# EAGLE design hifi (EAGLE 7.3.0)
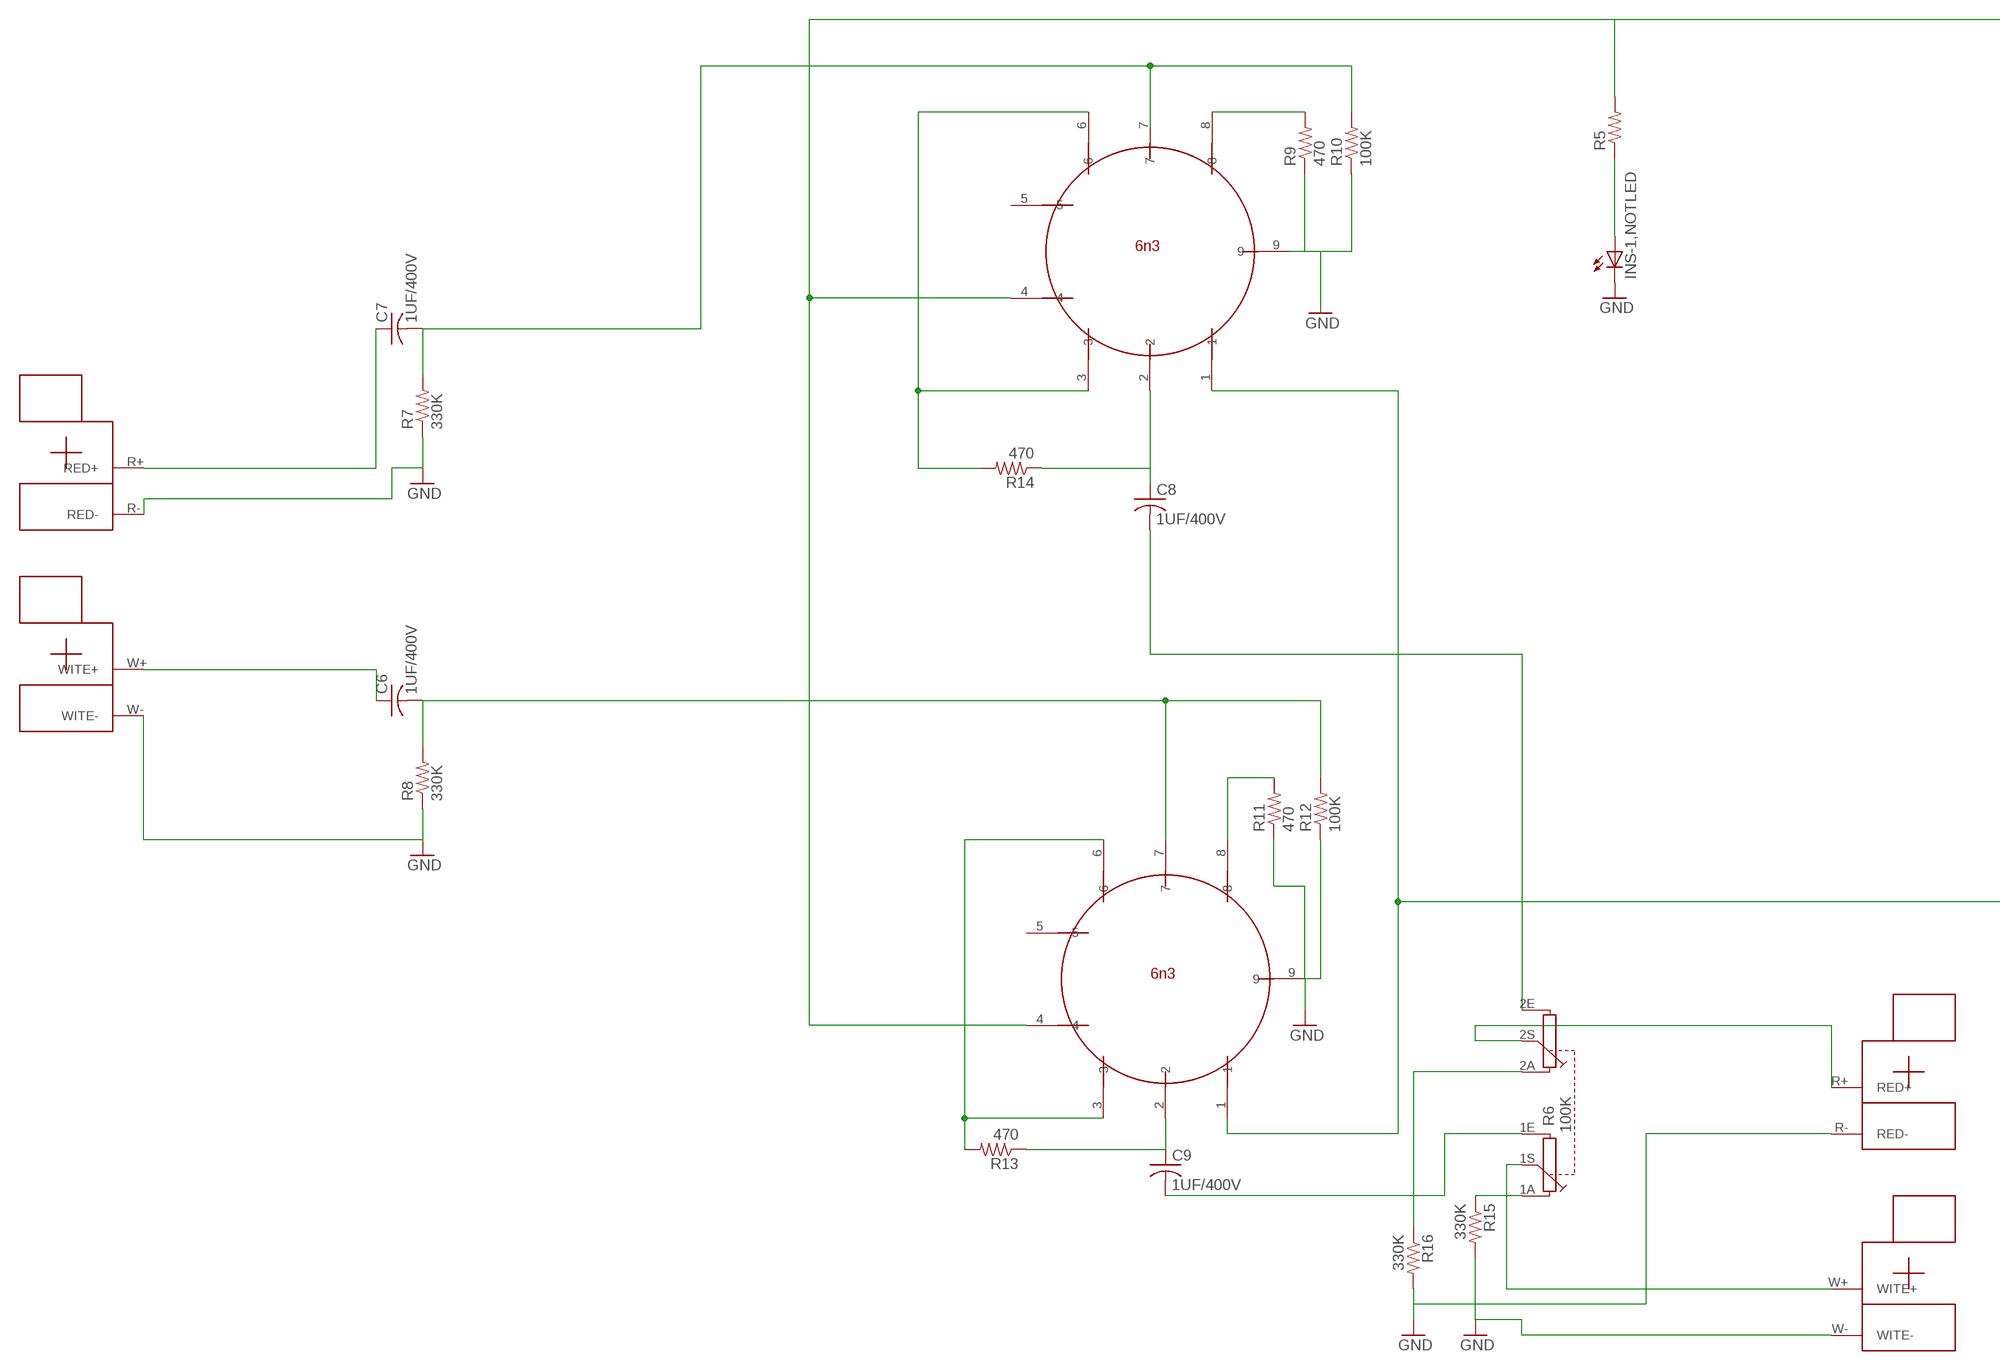
[diagram p0: schematic, sheet 1, part 1 of 2]
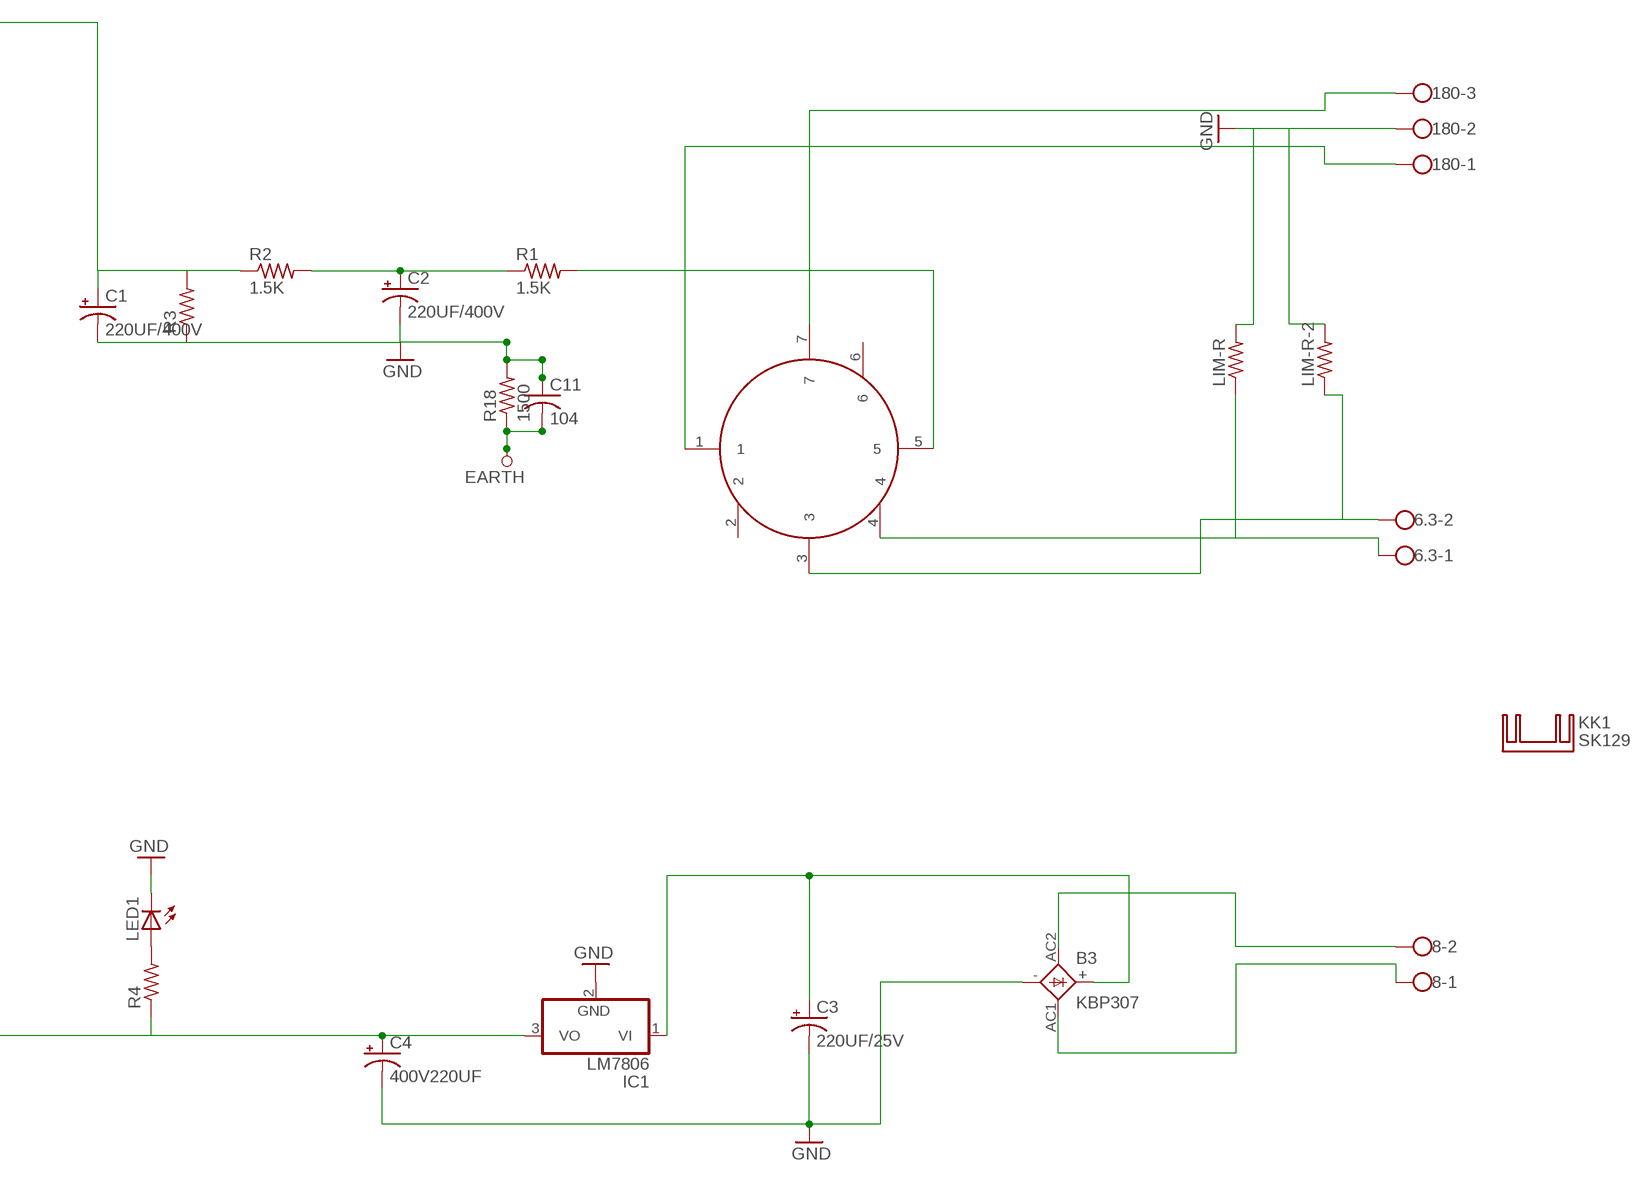
[diagram p1: schematic, sheet 1, part 2 of 2]

## Parts
6.3  W237-102  [W237-102]
8  W237-102  [W237-102]
180  W237-103  [W237-103]
B3  KBP307  KBL  [KBL]
C1  220UF/400V  CPOL-USE10-35  [EB35D]
C2  220UF/400V  CPOL-USE10-35  [EB35D]
C3  220UF/25V  CPOL-USE3.5-10  [E3,5-10]
C4  400V220UF  CPOL-USE10-30  [EB30D]
C6  1UF/400V  C-US375-192X418  [C375-192X418]
C7  1UF/400V  C-US375-192X418  [C375-192X418]
C8  1UF/400V  C-US375-192X418  [C375-192X418]
C9  1UF/400V  C-US375-192X418  [C375-192X418]
C11  104  C-US075-052X106  [C075-052X106]
EARTH  PAD_TERMINAL-4.1MMROUND  [PAD_ROUND_4.1MM]
IC1  LM7806  7805TV  [TO220V]
INS-1,NOTLED  LED5MM  [LED5MM]
KK1  SK129  [SK129-HOLE]
LED1  LED5MM  [LED5MM]
LIM-R  R-US_0207/10  [0207/10]
LIM-R-2  R-US_0207/10  [0207/10]
R1  1.5K  R-US_0309/12  [0309/12]
R2  1.5K  R-US_0309/12  [0309/12]
R3  R-US_0309/12  [0309/12]
R4  R-US_0207/10  [0207/10]
R5  R-US_0309/12  [0309/12]
R6  100K  PC16D  [PC16D]
R7  330K  R-US_0207/10  [0207/10]
R8  330K  R-US_0207/10  [0207/10]
R9  470  R-US_0207/10  [0207/10]
R10  100K  R-US_0207/10  [0207/10]
R11  470  R-US_0207/10  [0207/10]
R12  100K  R-US_0207/10  [0207/10]
R13  470  R-US_0207/10  [0207/10]
R14  470  R-US_0207/10  [0207/10]
R15  330K  R-US_0207/10  [0207/10]
R16  330K  R-US_0207/10  [0207/10]
R18  1500  R-US_0309/12  [0309/12]
U$1  6Z4-SIMPLE  [MINI_P7]
U$2  6N3-SIMPLE  [NOVAL]
U$3  6N3-SIMPLE  [NOVAL]
U$4  RCANEW  [RCA]
U$5  RCANEW  [RCA]

## Nets
GND: 180.2 B3.- C1.- C2.- C3.- C4.- C11.1 IC1.2(GND) INS-1,NOTLED.K(C) LED1.K(C) LIM-R-2.2 LIM-R.2 R3.1 R7.1 R8.1 R11.1 R12.1 R15.2 R16.2 R18.2 U$3.9 U$4.R-(RED-) U$4.W-(WITE-) U$5.R-(RED-) U$5.W-(WITE-)
N$1: 180.3 U$1.7
N$2: 8.2 B3.AC2(AC1)
N$3: 180.1 U$1.1
N$4: 6.3.1 LIM-R.1 U$1.4
N$5: 6.3.2 LIM-R-2.1 U$1.3
N$6: 8.1 B3.AC1(AC2)
N$7: B3.+ C3.+ IC1.1(VI)
N$8: C4.+ IC1.3(VO) R4.1 U$2.1 U$3.1
N$9: INS-1,NOTLED.A R5.1
N$10: C2.+ R1.1 R2.2
N$11: C11.2 EARTH.P R18.1
N$12: C6.1 U$4.W+(WITE+)
N$13: R1.2 U$1.5
N$15: C1.+ R2.1 R3.2 R5.2 U$2.4 U$3.4
N$16: C7.1 U$4.R+(RED+)
N$17: LED1.A R4.2
N$18: R6.1S U$5.W+(WITE+)
N$19: C8.1 R14.1 U$2.2
N$20: C7.2 R7.2 R10.2
N$21: C6.2 R8.2 R12.2 U$3.7
N$22: R14.2 U$2.3 U$2.6
N$23: C8.2 R6.2E
N$24: R6.2A R16.1
N$25: R6.1A R15.1
N$26: C9.2 R6.1E
N$27: C9.1 R13.1 U$3.2
N$30: R13.2 U$3.3 U$3.6
N$31: R6.2S U$5.R+(RED+)
N$32: R9.1 R10.1 U$2.9
N$33: R9.2 U$2.8
N$35: R11.2 U$3.8
Unconnected: U$1.2 U$1.6 U$2.5 U$2.7 U$3.5

## Library data of the parts
6.3 8 = con-wago-500:W237-102: WAGO SCREW CLAMP; MPN: 237-102; OC_FARNELL: unknown; OC_NEWARK: 70K9898
180 = con-wago-500:W237-103: WAGO SCREW CLAMP; MPN: 237-103; OC_FARNELL: unknown; OC_NEWARK: 18M7116
B3 = rectifier:KBL: DIOTEC RECTIFIER
C1-C4 = rcl:CPOL-US: POLARIZED CAPACITOR, American symbol
C6-C9 C11 = rcl:C-US: CAPACITOR, American symbol
EARTH = dp_devices:PAD_TERMINAL: Terminal connection pad
IC1 = linear:78*: Positive VOLTAGE REGULATOR Source: http://cache.national.com/ds/LM/LM78L05.pdf http://www.fairchildsemi.com/ds/LM/LM7805.pdf
INS-1,NOTLED LED1 = adafruit:LED: LED OSRAM: - CHIPLED LG R971, LG N971, LY N971, LG Q971, LY Q971, LO R971, LY R971 LH N974, LH R974 LS Q976, LO Q976, LY Q976 LO Q996 - Hyper CHIPLED LW Q18S LB Q993, LB Q99A, LB R99A - SideLED LS A670, LO A670, LY A670, LG A670, LP A670 LB A673, LV A673, LT A673, LW A673 LH A674 LY A675 LS A676, LA A676, LO A676, LY A676, LW A676 LS A679, LY A679, LG A679 - Hyper Micro SIDELED® LS Y876, LA Y876, LO Y876, LY Y876 LT Y87S - SmartLED LW L88C, LW L88S LB L89C, LB L89S, LG L890 LS L89K, LO L89K, LY L89K LS L896, LA L896, LO L896, LY L896 - TOPLED LS T670, LO T670, LY T670, LG T670, LP T670 LSG T670, LSP T670, LSY T670, LOP T670, LYG T670 LG T671, LOG T671, LSG T671 LB T673, LV T673, LT T673, LW T673 LH T674 LS T676, LA T676, LO T676, LY T676, LB T676, LH T676, LSB T676, LW T676 LB T67C, LV T67C, LT T67C, LS T67K, LO T67K, LY T67K, LW E67C LS E67B, LA E67B, LO E67B, LY E67B, LB E67C, LV E67C, LT E67C LW T67C LS T679, LY T679, LG T679 LS T770, LO T770, LY T770, LG T770, LP T770 LB T773, LV T773, LT T773, LW T773 LH T774 LS E675, LA E675, LY E675, LS T675 LS T776, LA T776, LO T776, LY T776, LB T776 LHGB T686 LT T68C, LB T68C - Hyper Mini TOPLED® LB M676 - Mini TOPLED Santana® LG M470 LS M47K, LO M47K, LY M47K Source: http://www.osram.convergy.de/
KK1 = heatsink:SK129: HEATSINK manufacturer Fischer/distributor Buerklin
LIM-R LIM-R-2 R1-R5 R7-R16 R18 = rcl:R-US_: RESISTOR, American symbol
R6 = piher:PC16D: POTENTIOMETER tandem carbon potentiometer, 16 mm, S3ROH; OC_FARNELL: 4453049; OC_NEWARK: unknown
U$1 = 百年秘制北京特色tube supl:6Z4-SIMPLE
U$2 U$3 = 百年秘制北京特色tube supl:6N3-SIMPLE
U$4 U$5 = con-amphenol:RCANEW

## Board
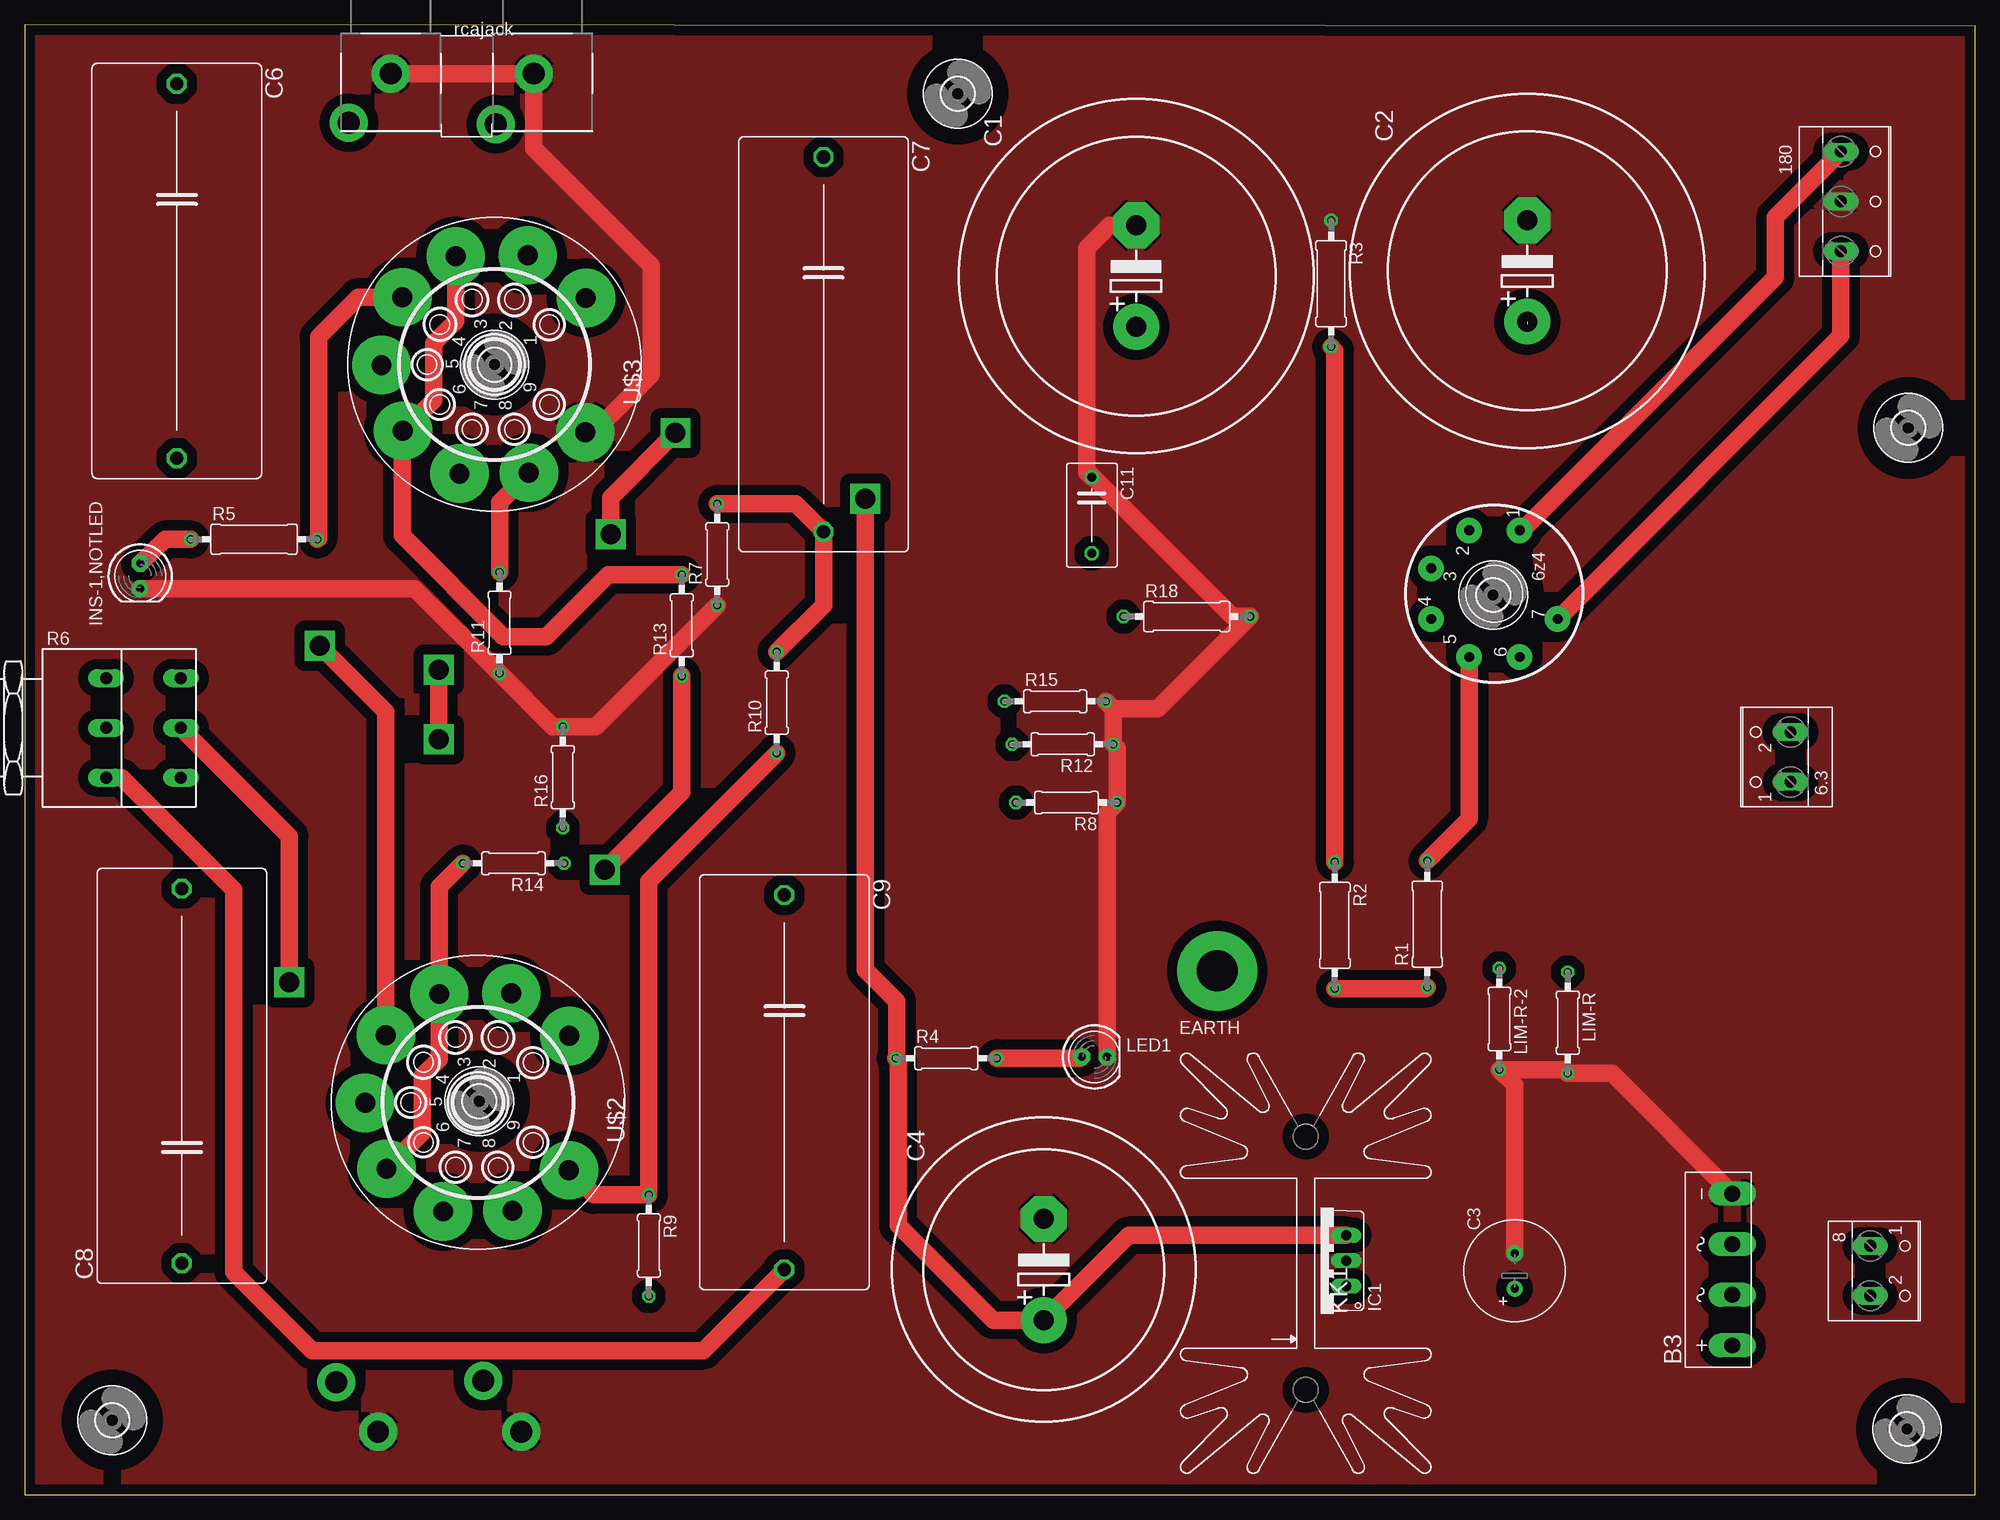
[diagram p2: board, top side]
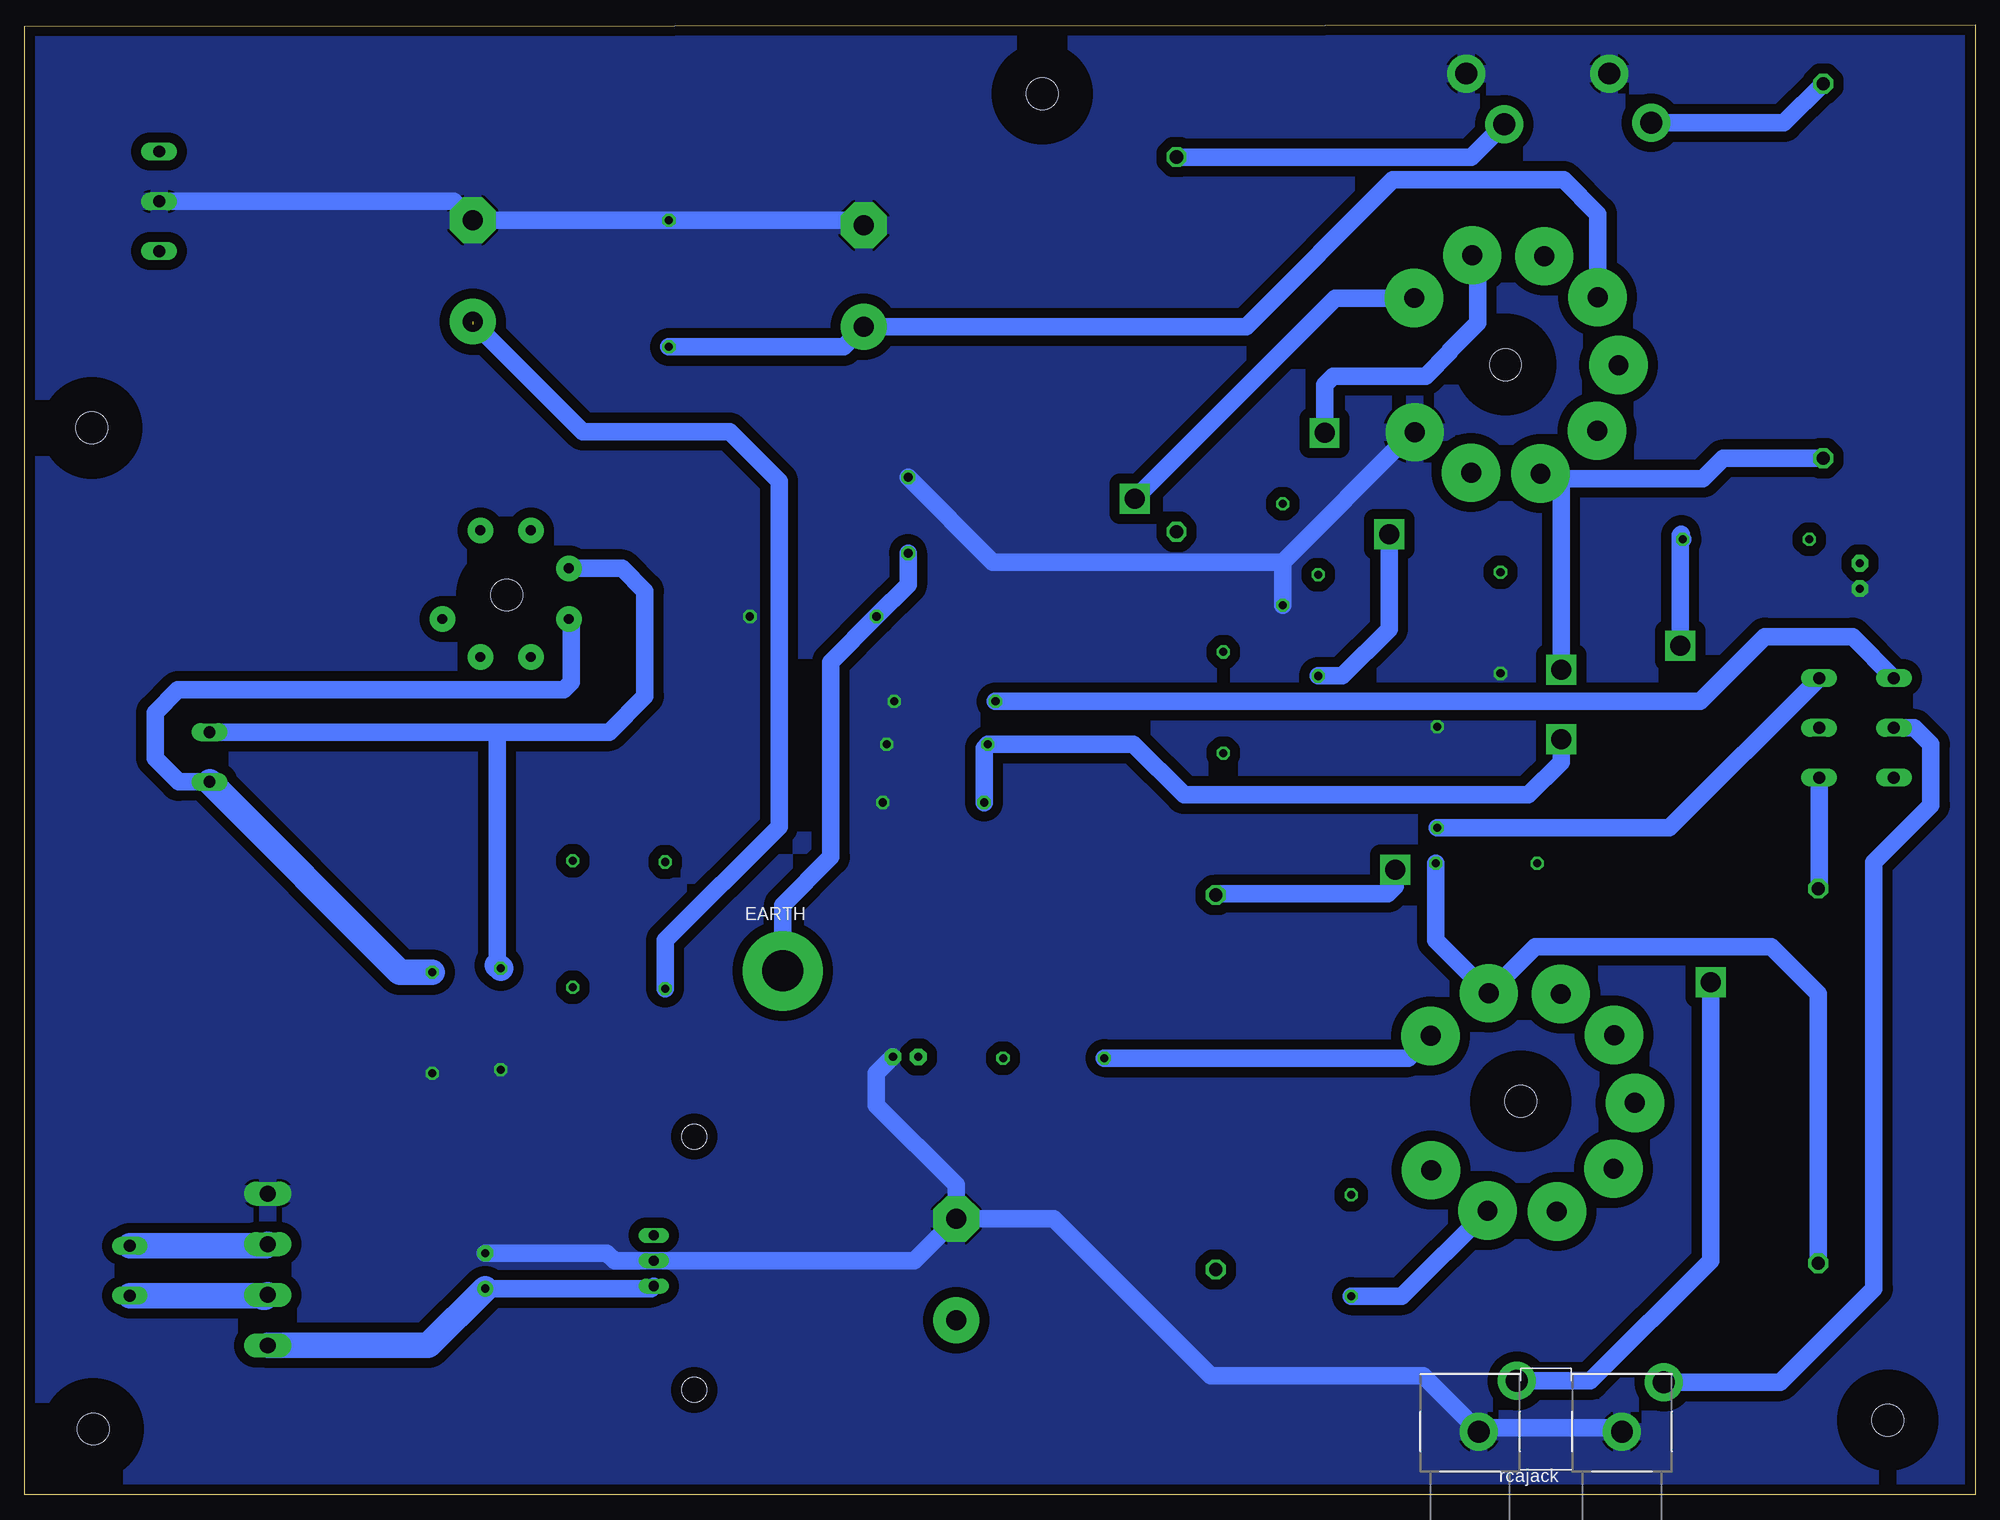
[diagram p3: board, bottom side, seen from below]

Size 195.69 x 147.5 mm. Coordinates in mm from the lower left corner, seen from the top.
Outline: 0,0 195.69,0 195.69,147.37 0,147.5 0,0
Copper layers (1*16): Top 0.035mm / dielectric 1.5mm / Bottom 0.035mm
Design rules "default": minimum track width 10mil, minimum drill 24mil, track to track 8mil, track to pad 8mil, pad to pad 8mil, via to via 8mil, smd to smd 8mil, copper to edge 40mil, drill to drill 8mil, minimum pad ring 10mil, minimum via ring 8mil, stop-mask expansion 4mil, vias tented up to drill 0mil, thermal gap 10mil

### Footprints (pad centres in the part's own frame; a part is rotated, then mirrored left to right if it is on the bottom)
W237-102 = drill 1.194 long: 1 -2.5,-1.27; 2 2.5,-1.27
W237-103 = drill 1.194 long: 1 -5,-1.29; 2 0,-1.29; 3 5,-1.29
KBL = drill 1.6 long: + -7.62,-1.27; - 7.62,-1.27; AC1 2.54,-1.27; AC2 -2.54,-1.27
EB35D = drill 2.007 pad 4.597: + -5.08,0 | drill 2.007 pad 4.597 octagon: - 5.08,0
E3,5-10 = drill 0.813 pad 1.6: + -1.778,0 | drill 0.813 pad 1.6 octagon: - 1.778,0
EB30D = drill 2.007 pad 4.597: + -5.08,0 | drill 2.007 pad 4.597 octagon: - 5.08,0
C375-192X418 = drill 1.321 octagon: 1 -18.796,0; 2 18.796,0
C075-052X106 = drill 0.914 octagon: 1 -3.81,0; 2 3.81,0
PAD_ROUND_4.1MM = drill 4.1 pad 8: P 0,0
TO220V = drill 1.016 long: 1 -2.54,-2.54; 2 0,-2.54; 3 2.54,-2.54
LED5MM = drill 0.813 pad 1.676 octagon: A -1.27,0; K 1.27,0
SK129-HOLE = hole 2.54: -12.7,-0.889; 12.7,-0.889
0207/10 = drill 0.813 octagon: 1 -5.08,0; 2 5.08,0
0309/12 = drill 0.813 octagon: 1 -6.35,0; 2 6.35,0
PC16D = drill 1.2 long: 1A -5,6.5; 1E 5,6.5; 1S 0,6.5; 2A -5,14; 2E 5,14; 2S 0,14
MINI_P7 = drill 1 pad 2.54: 1 6.35,-2.54; 2 6.35,2.54; 3 2.54,6.35; 4 -2.54,6.35; 5 -6.35,2.54; 6 -6.35,-2.54; 7 -2.54,-6.35
NOVAL = drill 2 pad 5.842: 1 6.682,-9.176; 2 10.961,-3.335; 3 10.884,3.896; 4 6.763,9.239; 5 -0.047,11.334; 6 -6.646,9.182; 7 -10.936,3.508; 8 -10.847,-3.457; 9 -6.788,-9.12
RCA = drill 2.2 pad 3.81: R+ 5.08,-4.699; R- 0,-0.889; W+ 4.953,-19.431; W- 0,-15.24
3,2 = hole 3.2: 0,0

### Placement (x,y rotation side)
6.3  175.89,74.04 90 top
8  186.44,22.48 270 top
180  183.51,129.79 270 top
B3  170.05,22.61 90 top
C1  111.51,122.3 90 top
C2  150.75,122.81 90 top
C3  149.48,22.48 90 top
C4  102.23,22.61 90 top
C6  15.24,122.81 270 top
C7  80.14,115.44 270 top
C8  15.75,42.04 90 top
C9  76.2,41.4 270 top
C11  107.06,98.3 270 top
EARTH  119.63,52.58 0 bottom
IC1  130.05,23.5 90 top
INS-1,NOTLED  11.56,92.2 270 top
KK1  127.63,23.24 90 top
LED1  107.31,43.94 0 top
LIM-R  154.81,47.37 270 top
LIM-R-2  147.95,47.75 270 top
R1  140.72,57.28 90 top
R2  131.44,57.15 270 top
R3  131.06,121.54 270 top
R4  92.46,43.81 0 top
R5  22.99,95.89 0 top
R6  1.65,76.96 270 top
R7  69.47,94.36 90 top
R8  104.52,69.47 180 top
R9  62.61,25.02 270 top
R10  75.44,79.5 90 top
R11  47.62,87.5 90 top
R12  104.14,75.31 180 top
R13  65.91,87.25 90 top
R14  49.02,63.37 180 top
R15  103.38,79.63 0 top
R16  53.97,72.01 90 top
R18  116.59,88.14 0 top
U$1  147.45,90.42 90 top
U$2  45.47,39.37 90 top
U$3  47.12,113.41 90 top
U$4  51.94,142.62 270 top
U$5  50.67,6.35 90 bottom
U$6  [3,2]  188.98,107.06 0 top
U$7  [3,2]  188.85,6.6 0 top
U$8  [3,2]  8.76,7.49 0 top
U$9  [3,2]  93.6,140.59 0 top
U$10  [3,2]  47.12,113.41 0 top
U$11  [3,2]  45.59,39.5 0 top
U$12  [3,2]  147.32,90.3 0 top

### Tracks (layer width: path | path; a pad name or v marks a point on that pad's centre or on a via)
GND
  Top 1.778: C3.- 149.48,41.15 LIM-R-2.2 154.43,42.67 LIM-R.2 159.26,42.29 B3.- | LED1.K 108.58,68.45 R8.1 109.6,74.93 R12.1 109.22,78.87 | 109.22,78.87 R15.2 | 111.89,127.76 C1.- 108.84,127.38 106.55,125.09 106.55,102.74 | U$4.W- U$4.R- 51.05,135.13 62.86,123.32 62.86,112.39 56.77,106.3 56.56,106.3 U$3.9 | INS-1,NOTLED.K 39.12,90.93 R11.1 52.96,77.09 R16.2 57.28,77.09 R7.1 | 106.55,102.74 106.55,102.62 C11.1 | 109.22,78.87 113.66,78.87 R18.2 121.16,88.14 106.55,102.74
  Bottom 1.778: C4.- 106.43,23.5 IC1.2 136.52,23.5 137.29,24.26 C3.- | C4.- 102.23,31.11 110.24,39.12 110.24,42.29 LED1.K | C4.- 92.46,27.69 76.71,11.94 55.37,11.94 50.16,6.73 35.81,6.73 U$5.W- | C1.- 112.01,127.89 R3.1 C2.- 152.65,129.79 180.2 | R7.1 69.47,93.6 | 69.47,93.6 56.77,106.3 56.56,106.3 U$3.9 | 69.47,93.6 98.55,93.6 C11.1
  pour Bottom (isolate 1.016): 0,147.32 195.45,147.32 195.71,147.07 195.71,0.13 195.33,-0.25 -0.13,-0.25 -0.25,-0.13 -0.25,147.07
  pour Top (isolate 1.016): 0,-0.13 0,147.19 -0.13,147.32 195.45,147.32 195.71,147.07 195.71,0 195.58,-0.13
N$1
  Top 1.778: 180.3 182.22,116.31 U$1.7
N$2
  Bottom 2.54: 8.2 172,19.98 171.83,19.81 171.58,19.81 B3.AC2
N$3
  Top 1.778: U$1.1 150.24,96.77 175.64,122.17 175.64,128.21 180.1
N$4
  Bottom 1.778: 6.3.1 180.25,71.54 182.63,73.91 182.63,78.49 180.34,80.77 141.6,80.77 140.84,81.53 140.84,87.63 U$1.4
  Bottom 2.54: LIM-R.1 158.07,52.45 6.3.1
N$5
  Bottom 1.778: 6.3.2 147.95,76.54 | 147.95,76.54 137.07,76.54 133.48,80.14 133.48,90.68 135.76,92.96 U$1.3 | 148.27,53.15 148.27,76.22 147.95,76.54
  Bottom 2.54: 148.27,53.15 LIM-R-2.1
N$6
  Bottom 2.54: 8.1 171.49,24.98 B3.AC1
N$7
  Bottom 1.778: C3.+ 132.84,20.7 IC1.1
  Bottom 2.54: B3.+ 155.19,14.99 C3.+
N$8  (via drill 2)
  Top 1.778: IC1.3 110.74,26.04 C4.+ 97.15,17.53 87.63,27.05 87.63,43.56 R4.1 87.5,43.94 87.5,49.53 84.33,52.7 v84.33,99.95
  Bottom 1.778: R4.1 56.88,43.81 U$2.1 | U$3.1 64.18,120.09 v84.33,99.95
N$9
  Top 1.778: R5.1 14.1,95.89 INS-1,NOTLED.A
N$10  (1 unrouted)
  Top 1.778: R2.2 140.59,50.8 R1.1
  Bottom 1.778: R2.2 131.44,55.63 120.02,67.06 120.02,101.73 124.97,106.68 139.7,106.68 C2.+ | 150.75,117.47 150.75,116.84
N$11
  Bottom 1.778: C11.2 107.06,91.31 R18.1 114.81,83.57 114.81,64.01 119.63,59.18 EARTH.P
N$12
  Bottom 1.778: U$4.W+ 19.18,137.67 C6.1
N$13
  Top 1.778: U$1.5 144.91,67.82 R1.2
N$15  (via drill 2)
  Top 1.778: R2.1 131.44,114.81 R3.2 | U$3.4 33.43,120.17 29.46,116.2 29.46,96.01 R5.2 | U$2.4 36.23,78.58 v29.59,85.22
  Bottom 1.778: R3.2 113.54,115.19 C1.+ 73.15,117.22 58.42,131.95 41.28,131.95 37.85,128.52 37.85,120.21 U$3.4 | v29.59,85.22 29.59,96.27 29.46,96.39 29.46,96.01 R5.2
N$16
  Bottom 1.778: C7.1 50.55,134.24 U$4.R+
N$17
  Top 1.778: R4.2 105.92,43.81 LED1.A
N$18
  Bottom 1.778: U$5.W+ 19.56,11.3 10.16,20.7 10.16,63.5 4.44,69.22 4.44,75.31 6.1,76.96 R6.1S
N$19
  Bottom 1.778: C8.1 15.75,50.29 20.45,54.99 44.14,54.99 U$2.2 54.1,55.63 R14.1
N$20
  Top 1.778: R7.2 77.34,99.44 C7.2 80.14,89.28 R10.2
N$21  (via drill 2)
  Top 1.778: v41.53,75.82 v41.53,82.8
  Bottom 1.778: C6.2 25.27,104.01 27.31,101.98 42.67,101.98 | 42.67,101.98 43.11,101.98 U$3.7 | R8.2 99.44,74.93 R12.2 84.45,75.31 79.38,70.23 44.83,70.23 41.53,73.53 v41.53,75.82 | v41.53,82.8 41.53,101.22 41.91,101.22 42.67,101.98
N$22
  Top 1.778: U$2.6 39.88,36.32 39.88,42.04 41.57,43.73 U$2.3 41.57,61 R14.2
N$23
  Bottom 1.778: R6.2E 15.65,60.93 C8.2
N$24
  Bottom 1.778: R16.1 30.68,66.93 R6.2A
N$25
  Bottom 1.778: R15.1 27.56,79.63 21.08,86.11 12.29,86.11 R6.1A
N$26
  Top 1.778: R6.1E 9.7,71.96 20.95,60.71 20.95,22.35 28.83,14.48 68.07,14.48 C9.2
N$27  (via drill 2)
  Top 1.778: R13.1 65.91,70.48 v58.17,62.74 | v58.8,96.39 58.8,100.08 v65.28,106.55
  Bottom 1.778: v58.17,62.74 58.17,61.09 58.93,60.33 76.07,60.33 C9.1 | R13.1 63.5,82.17 58.8,86.87 v58.8,96.39 | v65.28,106.55 65.28,111.38 64.39,112.27 55.12,112.27 52.7,114.68 52.7,114.81 49.91,117.6 49.91,123.83 U$3.2
N$30
  Top 1.778: R13.2 58.55,92.33 52.32,86.11 48.01,86.11 37.85,96.27 37.85,106.68 U$3.6 41.02,109.85 41.02,115.57 43.22,117.77 U$3.3
N$31  (via drill 2)
  Top 1.778: v26.54,51.44 26.54,66.07 R6.2S
  Bottom 1.778: U$5.R+ 38.61,11.43 26.54,23.5 v26.54,51.44
N$32
  Top 1.778: U$2.9 57.07,30.1 R9.1 62.61,61.59 R10.1
N$33
  Bottom 1.778: R9.2 57.51,19.94 U$2.8
N$35
  Top 1.778: R11.2 47.62,99.61 U$3.8